# Altium project BÀI_1.PrjPcb (part 1 of 2)
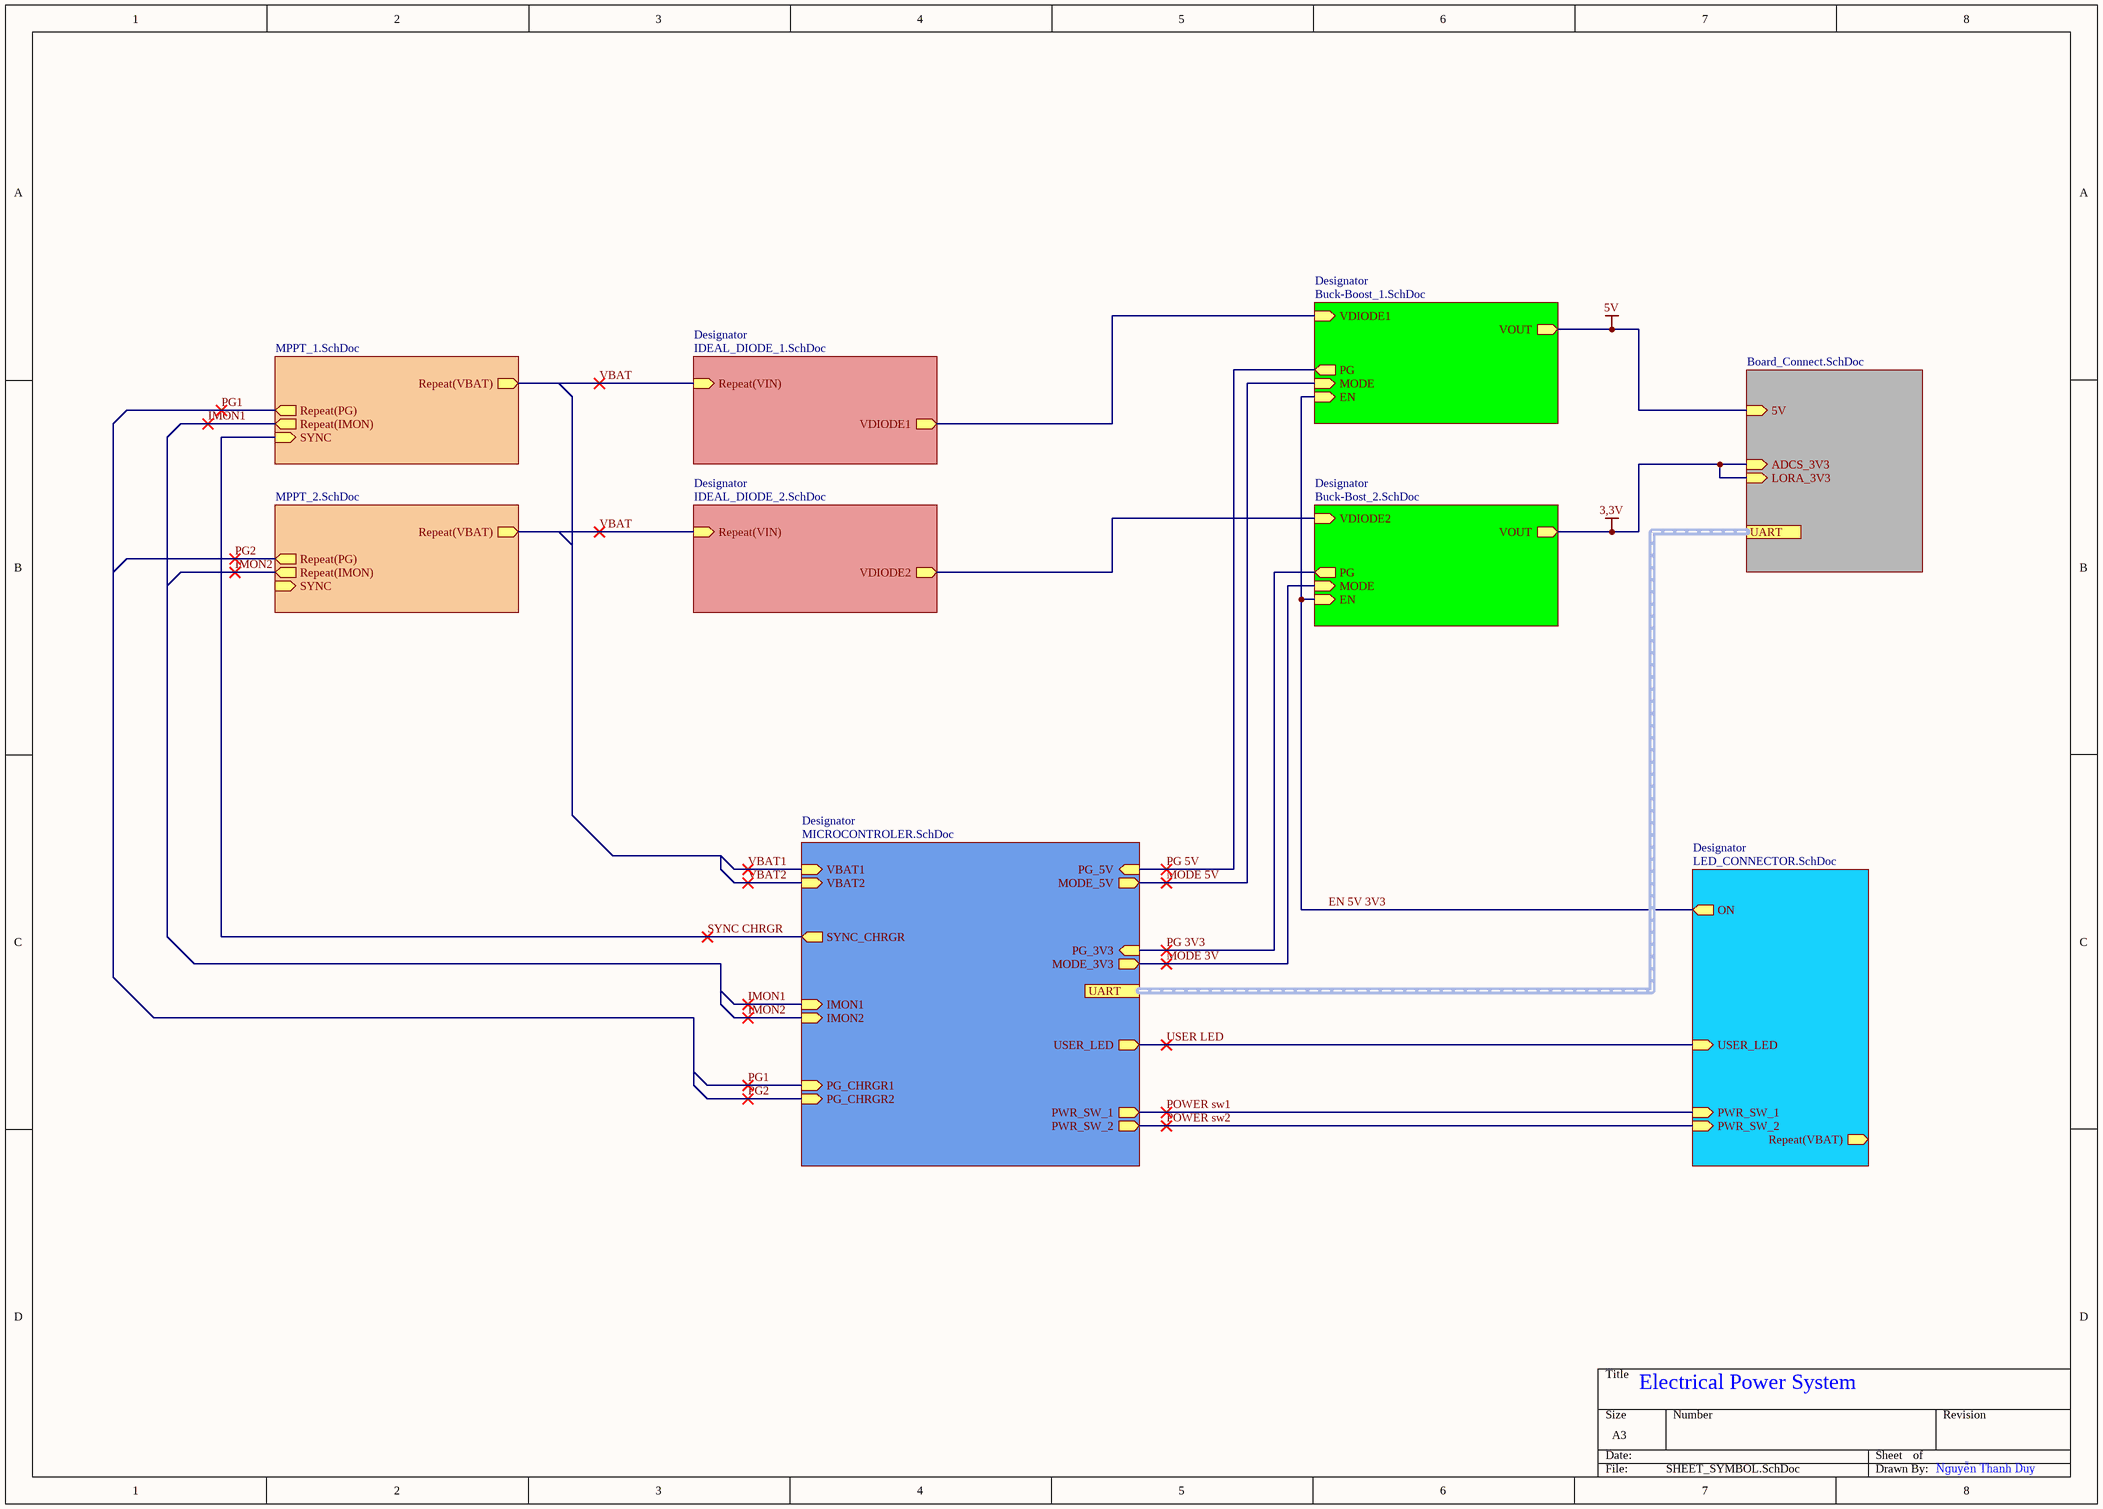
[diagram p0: SHEET_SYMBOL.SchDoc]
10 sheets, 124 parts. Net scope: flat (ports and power ports of the same name join across sheets).
Board files: PCB_4_LAYER.PcbDoc, PCB_2_LAYER.PcbDoc
Sheets:
  SHEET_SYMBOL.SchDoc
    Designator = MICROCONTROLER.SchDoc
    Designator = MPPT_1.SchDoc
    Designator = MPPT_2.SchDoc
    Designator = IDEAL_DIODE_1.SchDoc
    Designator = IDEAL_DIODE_2.SchDoc
    Designator = Buck-Boost_1.SchDoc
    Designator = Buck-Bost_2.SchDoc
    Designator = Board_Connect.SchDoc
    Designator = LED_CONNECTOR.SchDoc

## Sheet SHEET_SYMBOL.SchDoc
size A3; SheetNumber: 1; SheetTotal: 10

### Sub-sheets
Designator = MICROCONTROLER.SchDoc: VBAT1 (in), VBAT2 (in), SYNC_CHRGR (out), IMON1 (in), IMON2 (in), PG_CHRGR1 (in), PG_CHRGR2 (in), PG_5V (in), MODE_5V (out), PG_3V3 (in), MODE_3V3 (out), USER_LED (out), PWR_SW_1 (out), PWR_SW_2 (out)
Designator = MPPT_1.SchDoc: Repeat(PG) (out), Repeat(IMON) (out), Repeat(VBAT) (out), SYNC (in)
Designator = MPPT_2.SchDoc: Repeat(PG) (out), Repeat(IMON) (out), Repeat(VBAT) (out), SYNC (in)
Designator = IDEAL_DIODE_1.SchDoc: Repeat(VIN) (in), VDIODE1 (out)
Designator = IDEAL_DIODE_2.SchDoc: Repeat(VIN) (in), VDIODE2 (out)
Designator = Buck-Boost_1.SchDoc: VDIODE1 (in), PG (out), MODE (in), EN (in), VOUT (out)
Designator = Buck-Bost_2.SchDoc: VDIODE2 (in), PG (out), MODE (in), EN (in), VOUT (out)
Designator = Board_Connect.SchDoc: 5V (in), ADCS_3V3 (in), LORA_3V3 (in)
Designator = LED_CONNECTOR.SchDoc: ON (out), USER_LED (in), PWR_SW_1 (in), PWR_SW_2 (in), Repeat(VBAT) (out)

### Ports
UART (harness UART, see 1[5C], 3[2C], 10[1D]), UART (harness UART, see 1[7B], 3[2C], 10[1D])

### Nets
3,3V: sheet Designator/VOUT, sheet Designator/ADCS_3V3, sheet Designator/LORA_3V3
5V: sheet Designator/VOUT, sheet Designator/5V
EN 5V 3V3: sheet Designator/EN, sheet Designator/EN, sheet Designator/ON
IMON1: sheet Designator/IMON1, sheet Designator/Repeat(IMON)
IMON2: sheet Designator/IMON2, sheet Designator/Repeat(IMON)
MODE 3V: sheet Designator/MODE_3V3, sheet Designator/MODE
MODE 5V: sheet Designator/MODE_5V, sheet Designator/MODE
PG1: sheet Designator/PG_CHRGR1, sheet Designator/Repeat(PG)
PG2: sheet Designator/PG_CHRGR2, sheet Designator/Repeat(PG)
PG 3V3: sheet Designator/PG_3V3, sheet Designator/PG
PG 5V: sheet Designator/PG_5V, sheet Designator/PG
POWER sw1: sheet Designator/PWR_SW_1, sheet Designator/PWR_SW_1
POWER sw2: sheet Designator/PWR_SW_2, sheet Designator/PWR_SW_2
SYNC CHRGR: sheet Designator/SYNC_CHRGR, sheet Designator/SYNC
USER LED: sheet Designator/USER_LED, sheet Designator/USER_LED
VBAT: sheet Designator/Repeat(VBAT), sheet Designator/Repeat(VBAT), sheet Designator/Repeat(VIN), sheet Designator/Repeat(VIN)
VBAT1: sheet Designator/VBAT1
VBAT2: sheet Designator/VBAT2
(unnamed): sheet Designator/VDIODE1, sheet Designator/VDIODE1
(unnamed): sheet Designator/VDIODE2, sheet Designator/VDIODE2

### Notes on the sheet
- Electrical Power System
- Nguyễn Thanh Duy

## Sheet MICROCONTROLER.SchDoc
size A4; SheetNumber: 3; SheetTotal: 10
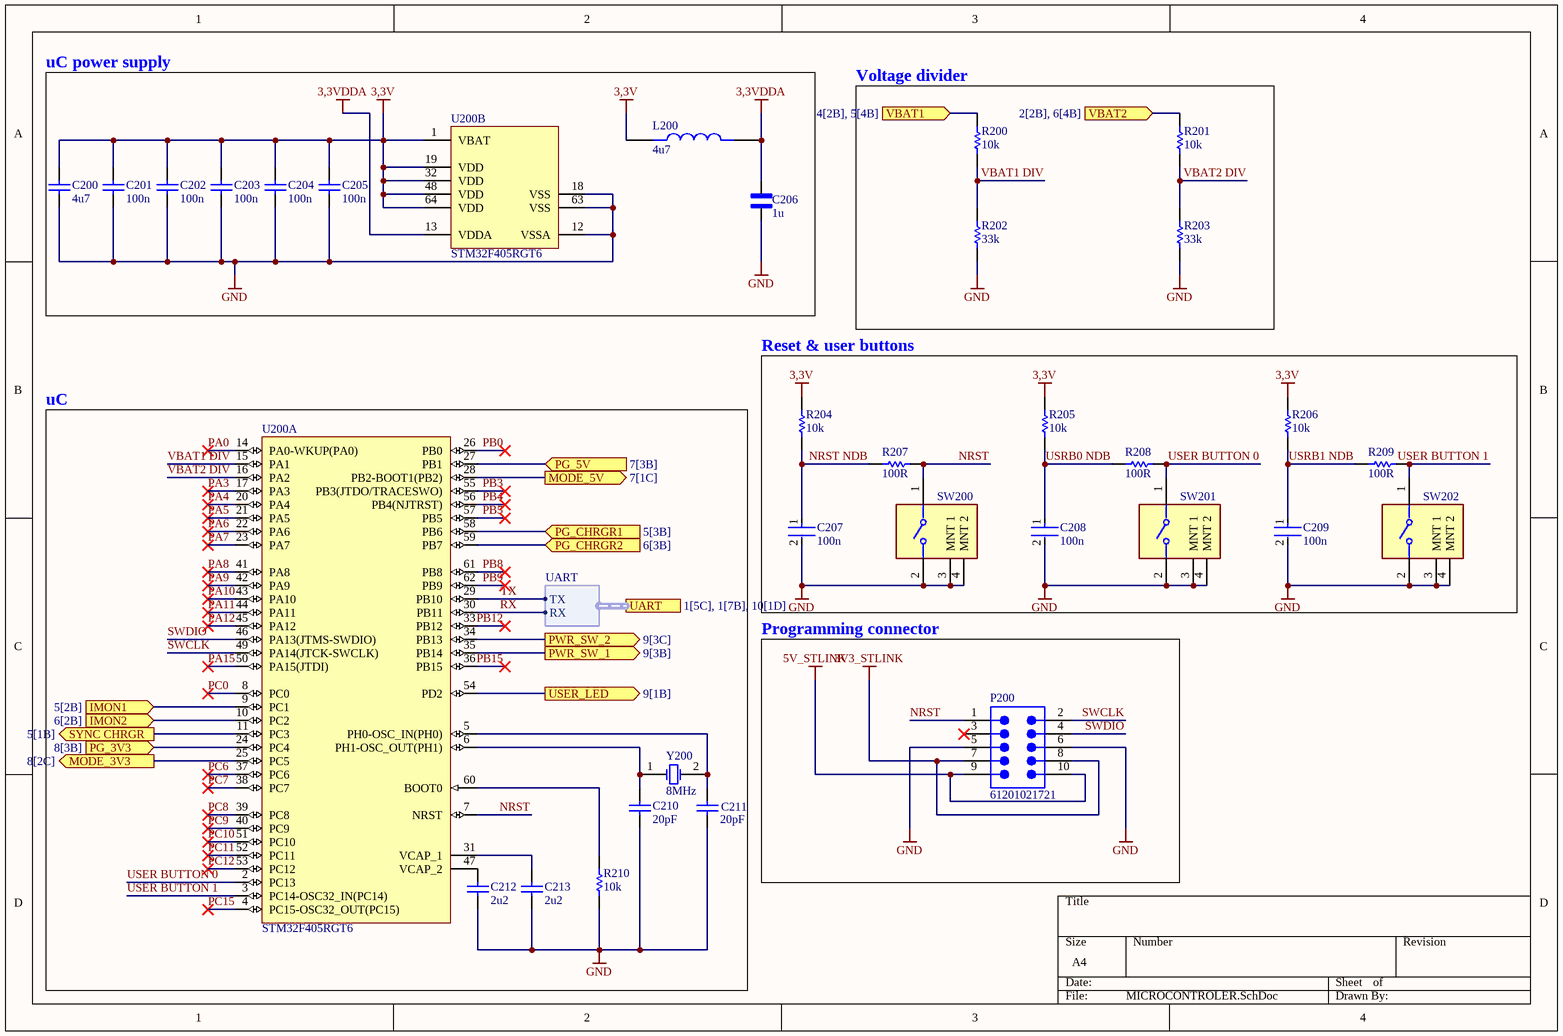
[diagram p1: MICROCONTROLER.SchDoc]

### Parts
C200  4u7  [CAPC1005X55X30LL05T10]
C201  100n  [CAPC1005X55X30LL05T10]
C202  100n  [CAPC1005X55X30LL05T10]
C203  100n  [CAPC1005X55X30LL05T10]
C204  100n  [CAPC1005X55X30LL05T10]
C205  100n  [CAPC1005X55X30LL05T10]
C206  1u  [CAPC1005X70N]
C207  100n  [FP-C0402-BB-MFG]
C208  100n  [FP-C0402-BB-MFG]
C209  100n  [FP-C0402-BB-MFG]
C210  20pF  [tu 0805]
C211  20pF  [tu 0805]
C212  2u2  [tu 0805]
C213  2u2  [tu 0805]
L200  4u7  [INDC2012X100N]
P200  61201021721  [61201021721]
R200  10k  [RESC1609X50X30NL8T20]
R201  10k  [RESC1609X50X30NL8T20]
R202  33k  [RESC1005X40X25ML05T10]
R203  33k  [RESC1005X40X25ML05T10]
R204  10k  [RESC1609X50X30NL8T20]
R205  10k  [RESC1609X50X30NL8T20]
R206  10k  [RESC1609X50X30NL8T20]
R207  100R  [RESC1005X40X25ML05T10]
R208  100R  [RESC1005X40X25ML05T10]
R209  100R  [RESC1005X40X25ML05T10]
R210  10k  [RESC1609X50X30NL8T20]
SW200  B3F-3152  [FP-B3F-3152-MFG]  (value not drawn)
SW201  B3F-3152  [FP-B3F-3152-MFG]  (value not drawn)
SW202  B3F-3152  [FP-B3F-3152-MFG]  (value not drawn)
U200  STM32F405RGT6  [STM-LQFP64_N]  (parts A,B of 2)
Y200  8MHz  [ABRA-ABLS-14.7456MHZ-B2-T_V]

### Blocks framed on the sheet
uC power supply: C200-C206 L200 U200
Voltage divider: R200-R203
uC: C210-C213 R210 U200 Y200
Reset & user buttons: C207-C209 R204-R209 SW200-SW202
Programming connector: P200

### Ports
IMON1 (in, see 5[2B]), IMON2 (in, see 6[2B]), MODE_3V3 (out, see 8[2C]), MODE_5V (out, see 7[1C]), PG_3V3 (in, see 8[3B]), PG_5V (in, see 7[3B]), PG_CHRGR1 (in, see 5[3B]), PG_CHRGR2 (in, see 6[3B]), PWR_SW_1 (out, see 9[3B]), PWR_SW_2 (out, see 9[3C]), SYNC CHRGR (out, see 5[1B]), UART (harness UART, see 1[5C], 1[7B], 10[1D]), USER_LED (out, see 9[1B]), VBAT1 (in, see 4[2B], 5[4B]), VBAT2 (in, see 2[2B], 6[4B])

### Harnesses
UART: TX, RX

### Nets
3,3V: C200.2 C201.2 C202.2 C203.2 C204.2 C205.2 L200.1 R204.2 R205.2 R206.2 U200.1(VBAT) U200.19(VDD) U200.32(VDD) U200.48(VDD) U200.64(VDD)
3,3VDDA: C206.2 L200.2 U200.13(VDDA)
3V3_STLINK: P200.7 P200.8
5V_STLINK: P200.9 P200.10
GND: C200.1 C201.1 C202.1 C203.1 C204.1 C205.1 C206.1 C207.2 C208.2 C209.2 C210.2 C211.2 C212.2 C213.2 P200.5 P200.6 R202.1 R203.1 R210.1 SW200.2 SW200.3(MNT_1) SW200.4(MNT_2) SW201.2 SW201.3(MNT_1) SW201.4(MNT_2) SW202.2 SW202.3(MNT_1) SW202.4(MNT_2) U200.12(VSSA) U200.18(VSS) U200.63(VSS)
G2: U200.34(PB13) ; port PWR_SW_2
NRST: P200.1 R207.2 SW200.1 U200.7(NRST)
NRST NDB: C207.1 R204.1 R207.1
PA0: U200.14(PA0-WKUP(PA0))
PA3: U200.17(PA3)
PA4: U200.20(PA4)
PA5: U200.21(PA5)
PA6: U200.22(PA6)
PA7: U200.23(PA7)
PA8: U200.41(PA8)
PA9: U200.42(PA9)
PA10: U200.43(PA10)
PA11: U200.44(PA11)
PA12: U200.45(PA12)
PA15: U200.50(PA15(JTDI))
PB0: U200.26(PB0)
PB3: U200.55(PB3(JTDO/TRACESWO))
PB4: U200.56(PB4(NJTRST))
PB5: U200.57(PB5)
PB8: U200.61(PB8)
PB9: U200.62(PB9)
PB12: U200.33(PB12)
PB15: U200.36(PB15)
PC0: U200.8(PC0)
PC6: U200.37(PC6)
PC7: U200.38(PC7)
PC8: U200.39(PC8)
PC9: U200.40(PC9)
PC10: U200.51(PC10)
PC11: U200.52(PC11)
PC12: U200.53(PC12)
PC15: U200.4(PC15-OSC32_OUT(PC15))
PG: U200.58(PB6) ; port PG_CHRGR1
PG B: U200.59(PB7) ; port PG_CHRGR2
RX: U200.30(PB11) ; port UART.RX
SWCLK: P200.2 U200.49(PA14(JTCK-SWCLK))
SWDIO: P200.4 U200.46(PA13(JTMS-SWDIO))
TX: U200.29(PB10) ; port UART.TX
USER BUTTON 0: R208.2 SW201.1 U200.2(PC13)
USER BUTTON 1: R209.2 SW202.1 U200.3(PC14-OSC32_IN(PC14))
USRB0 NDB: C208.1 R205.1 R208.1
USRB1 NDB: C209.1 R206.1 R209.1
VBAT1 DIV: R200.1 R202.2 U200.15(PA1)
VBAT2 DIV: R201.1 R203.2 U200.16(PA2)
Net?_2: R200.2 ; port VBAT1
NetC210_1: C210.1 U200.6(PH1-OSC_OUT(PH1)) Y200.1(X1)
NetC211_1: C211.1 U200.5(PH0-OSC_IN(PH0)) Y200.2(X2)
NetC212_1: C212.1 U200.47(VCAP_2)
NetC213_1: C213.1 U200.31(VCAP_1)
NetC303B_1: R201.2 ; port VBAT2
NetD700_2: U200.54(PD2) ; port USER_LED
NetR210_2: R210.2 U200.60(BOOT0)
NetR302A_1: U200.11(PC3) ; port SYNC CHRGR
NetR500A_1: U200.28(PB2-BOOT1(PB2)) ; port MODE_5V
NetR500B_1: U200.25(PC5) ; port MODE_3V3
NetR700_1: U200.35(PB14) ; port PWR_SW_1
NetU200_9: U200.9(PC1) ; port IMON1
NetU200_10: U200.10(PC2) ; port IMON2
NetU200_24: U200.24(PC4) ; port PG_3V3
NetU200_27: U200.27(PB1) ; port PG_5V

Not connected (* = marked no-connect by the designer): P200 3*

### Library data of the parts
C200-C205 = CMP-0001-00074-2: Manufacturer: Kemet; Part Number: C0402C104K4RACTU
C206 = MAASL105CD7105MFCA01: MF: Taiyo Yuden; SnapEDA_Link: https://www.snapeda.com/parts/MAASL105CD7105MFCA01/Littelfuse/view-part/?ref=snap; Package: None; Value: *; MP: MAASL105CD7105MFCA01; Check_prices: https://www.snapeda.com/parts/MAASL105CD7105MFCA01/Littelfuse/view-part/?ref=eda
C207-C209 = CMP-2008-02046-2: CAP CER 0.1UF 10V X5R 0402; Manufacturer: Kemet; Manufacturer Part Number: C0402C104K8PACTU; Material: Ceramic; Capacitance: 0.10 μF; Temperature Coefficient: 15%; Tolerance: 0.1; Value: 0.10 μF; Package: C0402-BB; Temperature: -55°C to +125°C; ComponentLink2Description: Datasheet; Temperature Characteristic: X5R; Device Class L1: Passive Components; Height: 0.55mm; Lead Free: Yes; ComponentLink2URL: https://content.kemet.com/datasheets/KEM_C1002_X7R_SMD.pdf; Device Class L2: Capacitors; Temperature Range Low: -55°C; Temperature Range High: +125°C; RoHS: TRUE; Octopart: https://octopart.com/c0402c104k8pactu-kemet-140039; Automotive: No; Mouser Description: Capacitor 100 nF 10 VDC 0402; Category: Cap; Voltage Rating: 10 V; Digikey Description: CAP CER 0.1UF 10V X5R 0402; Ipc Land Pattern Name: CAPC10050X50; Device Class L3: Ceramic Capacitors
C210 C211 = Tu 0805 20pF 50V 10%: Dán; Don_Vi: Con; Ten_Linh_Kien: Tụ 0805 20P 10% 50V; So_Chan: 2; Ma_Hang: MH004558; Chung_Loai: Dán; Kieu_Chan: *
C212 C213 = Tu 0805 225 25V 10%: Dán; Don_Vi: Con; So_Chan: 2; Ten_Linh_Kien: Tụ 0805 225-2.2uF 25V 10%; Ma_Hang: MH007483; Chung_Loai: Dán; Kieu_Chan: *
L200 = MLP2012S4R7MT0S1: Surface Mount High Frequency Inductor, MLP Series, 4.7 H, 20%, 0805 [2012 Metric], 0.26 ohm; MF: TDK; Package: 2012 TDK; Price: None; Check_prices: https://www.snapeda.com/parts/MLP2012S4R7MT0S1/TDK/view-part/?ref=eda; Value: *; SnapEDA_Link: https://www.snapeda.com/parts/MLP2012S4R7MT0S1/TDK/view-part/?ref=snap; MP: MLP2012S4R7MT0S1; Availability: In Stock; Purchase-URL: https://pricing.snapeda.com/search/part/MLP2012S4R7MT0S1/?ref=eda
P200 = CMP-1502-00021-2: NexarPartId: 8917787; Operating Supply Voltage: 250V; Number of Positions: 10; Contact Resistance: 20mΩ; Connector Type: Male Pin; Current Rating: 3A; Pitch: 2.54mm; Gender: Male; Insulation Resistance: 1GΩ; Insulation: Insulated; Max Operating Temperature: 105°C; Flammability Rating: UL94 V-0; Mount: Through Hole; Contact Material: Copper; Min Operating Temperature: -40°C; Length: 20.36mm; Number of Contacts: 10; Height: 8.85mm; Number of Rows: 2; Housing Material: PBT; Color: Black; Contact Gender: Male; Orientation: Right Angle; Contact Plating: Gold; Number of Pins: 10; Voltage Rating (DC): 250V; RoHS: Compliant; Insulation Material: PBT; REACH SVHC: Unknown; Row Spacing: 2.54mm; Voltage Rating: 250V; Width: 20.36mm; Lead Pitch: 2.54mm; Termination: Through Hole
R200 R201 R204-R206 R210 = CMP-1666-00005-4: Chip Resistor, 10 KOhm, +/- 1%, 100 mW, -55 to 155 degC, 0603 (1608 Metric), RoHS, Tape and Reel; Manufacturer: Vishay Semiconductor; Voltage Rating: 75 V; Max Operating Temperature: 155 degC; PackageDescription: 2-Pin Surface Mount Device, Body 1.575 x 0.85 mm; ComponentLink1Description: Manufacturer URL; RoHSCompliant: true; PackageReference: 0603; REACH SVHC: Unknown; Length: 1.55 mm; DatasheetVersion: 06/2012; Packaging: Tape and Reel; Min Operating Temperature: -55 degC; Mounting Technology: Surface Mount; ComponentLink2URL: https://datasheet.ciiva.com/11809/0900766b80d98afc-11809037.pdf; Height: 0.45 mm; ComponentLink2Description: Datasheet; Package Quantity: 5000; ComponentLink1URL: http://www.vishay.com/
R202 R203 = CMP-2002-07617-1: Part Number: RC0402FR-0733KL; Manufacturer: Yageo / Phycomp
R207-R209 = CMP-2002-07344-1: Part Number: RC0402FR-07100RL; Manufacturer: Yageo / Phycomp
SW200-SW202 = CMP-08834-000033-1: SWITCH TACTILE SPST-NO 0.05A 24V; Mechanical Life: 300000Cycles; Max Current Rating: 50mA; Illumination Type: Non-Illuminated; Actuator Color: Yellow; Throw Configuration: SPST; Switch Function: Off-Mom; Ratings: IP00; Switch Travel: 0.25mm; Actuator Type: PLUNGER; Contact Resistance: 100mR; Number of Poles: 1; Operating Force: 1.47N; Height: 6.15mm; Contact Plating: Gold; Contact Type: 1 maker; Termination: PC Pins; Radiation Hardening: No; Contact Material: Gold; Number of Pins: 4; Length: 7.3mm; Width: 6mm; Weight: 0.25g; Packaging: Bulk; Contact Current Rating: 50mA; Max Operating Temperature: 70°C; Lead Free: Lead Free; Mount: Through Hole; RoHS Compliant: Yes; Series: B3F; Orientation: Right Angle; Package Quantity: 1000; Current Rating: 50mA; Max Voltage Rating (DC): 24V; Min Operating Temperature: -25°C; Electrical Life: 300000Cycles; Depth: 7.15mm; Voltage Rating (DC): 24V
U200 = CMP-0243-00019-3: ARM Cortex-M4 32-bit MCU+FPU, 210 DMIPS, 1024 kB Flash, 192 kB Internal RAM, 51 I/Os, 64-pin LQFP, -40 to 85 degC, Tray; Manufacturer: STMicroelectronics; Supply Voltage(Vcc) min (V): 1.8; Supply Voltage(Vcc) max (V): 3.6; Internal RAM Size (kB): 192; I/Os (High Current): 51; D/A Converter: 2x12-bit; FLASH Size (Prog) (kB): 1024; Operating Frequency(F) (Processor speed) (MHz): 168; ComponentLink2Description: Datasheet; PackageVersion: Rev. 4, 06/2013; DatasheetVersion: Rev. 4; Core: ARM Cortex-M4; ComponentLink2URL: http://www.st.com/st-web-ui/static/active/en/resource/technical/document/datasheet/DM00037051.pdf; PackageReference: LQFP64; Packing: Tray; ComponentLink1Description: Manufacturer URL; ComponentLink3URL: http://www.st.com/st-web-ui/static/active/en/resource/technical/document/datasheet/DM00037051.pdf; ComponentLink3Description: Package Specification; Mounting Technology: Surface Mount; ComponentLink1URL: http://www.st.com/web/en/home.html; PackageDescription: 64-Pin Low Profile Quad Flat Package, 10 x 10 mm Body, 0.5 mm Pitch; PartNumber: STM32F405RGT6
Y200 = CMP-2000-05726-1: Low Profile Crystal, 8.0 MHz, +/- 30 ppm, -20 to 70 degC, 2-Pin SMD, RoHS, Tape and Reel; Brand: ABRACON; Case Length: 11.4mm; Frequency Stability: 50PPM; ESR: 80Ohms; Case Height: 4.2mm; Tolerance: 30PPM; Case Width: 4.7mm; Load Capacitance: 18pF; Datasheet Version: 04/2011; Termination Style: SMD/SMT; Dimensions: 4.7mmWx11.4mmLx4.2mmH; Packaging: Reel; Manufacturer: ABRACON; Package URL: http://www.abracon.com/Support/PackageDrawing/Resonators/ABLS-2D.pdf; Mounting Technology: SurfaceMount; Package Reference: ABLS-14.7456MHZ-B2-T; Product Category: Crystals; Package Description: 2-Pin Surface Mount Device, Body 11.4 x 4.7 mm; Package / Case: HC-49/US; Mounting Style: SMD/SMT; Operating Temperature Range: -20Cto+70C; Series: ABLS; Frequency: 8MHz; Factory Pack Quantity: 1000; Datasheet URL: http://www.abracon.com/Resonators/abls.pdf; Manufacturer URL: http://www.abracon.com/; RoHS: Details; Type: LowProfileMicroprocessorCrystal

## Sheet MPPT_1.SchDoc
size A4; SheetNumber: 5; SheetTotal: 10
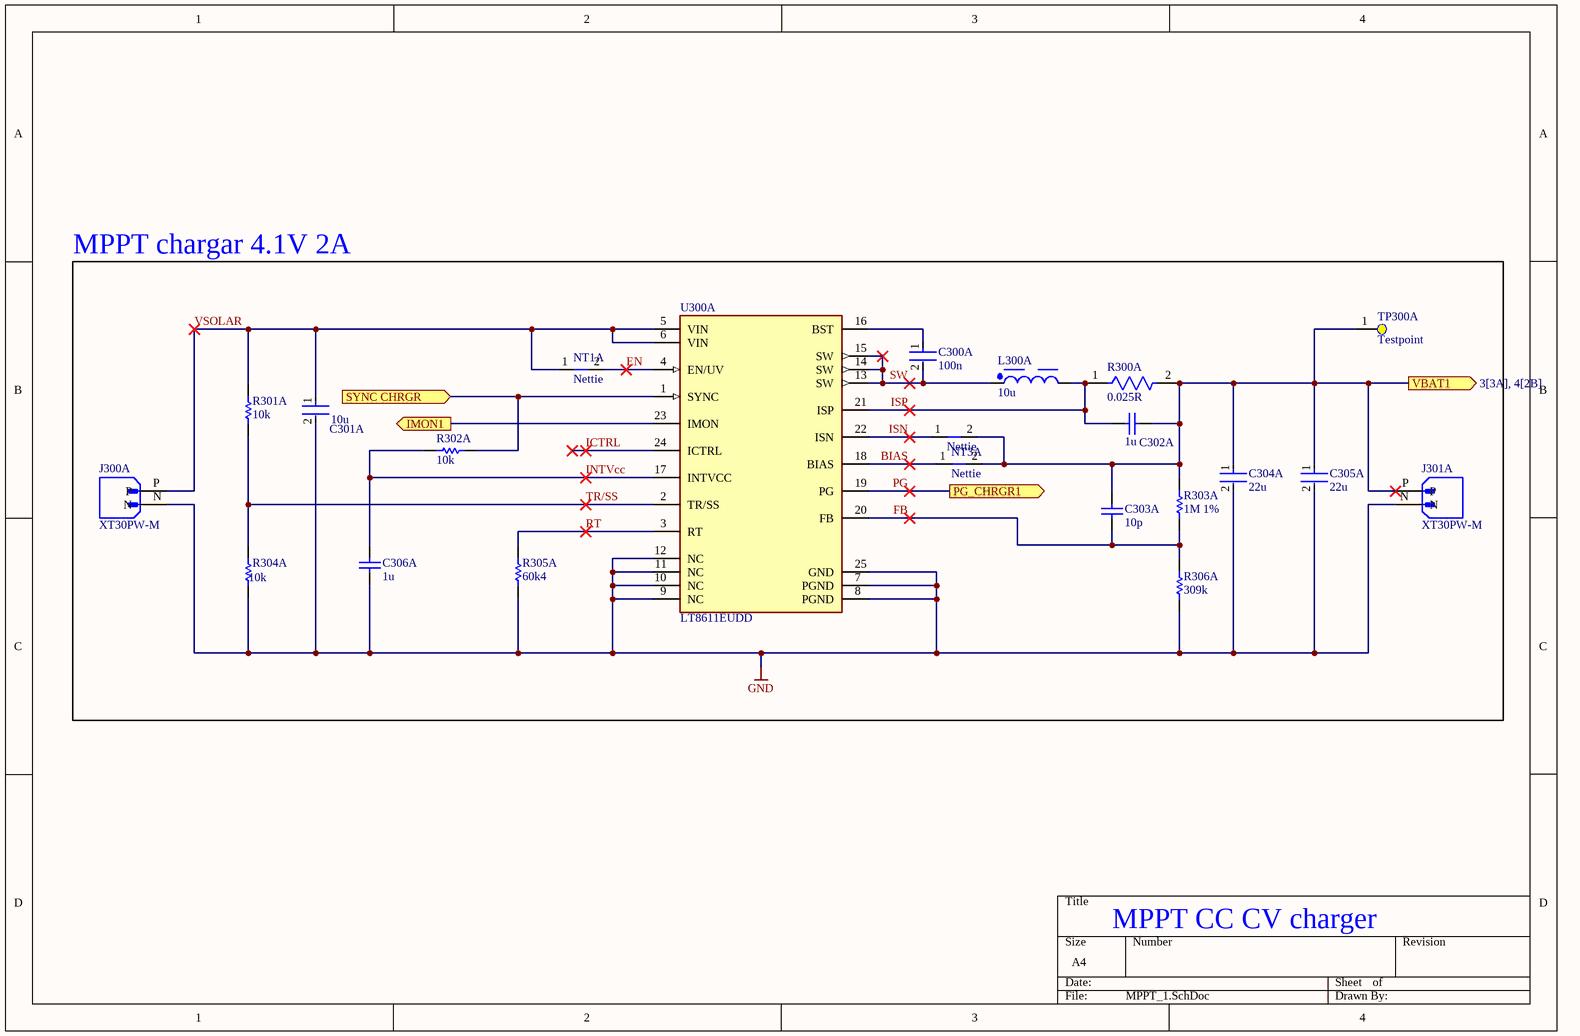
[diagram p2: MPPT_1.SchDoc]

### Parts
?  Nettie  [NET_TIE]
C300A  100n  [FP-0402B104K500CT-IPC_C]
C301A  10u  [FP-GRM31C-0_2-e0_3_0_8-MFG]
C302A  1u  [CAPC3216X110X50LL20T25]
C303A  10p  [CAPC1608X90X35LL10T15]
C304A  22u  [FP-GRM21B-0_15-IPC_B]
C305A  22u  [FP-GRM21B-0_15-IPC_B]
C306A  1u  [CAPC2013X140X50NL20T25]
J300A  XT30PW-M  [AMASS_XT30PW-M]
J301A  XT30PW-M  [AMASS_XT30PW-M]
L300A  10u  [WE-PD_7345]
NT1A  Nettie  [NET_TIE]
NT3A  Nettie  [NET_TIE]
R300A  0.025R  [FP-WSL2512-0_762-MFG]
R301A  10k  [RESC1609X50X30NL8T20]
R302A  10k  [RESC1609X50X30NL8T20]
R303A  1M 1%  [RESC1005X40X25NL05T10]
R304A  10k  [RESC1609X50X30NL8T20]
R305A  60k4  [RESC2013X50X30NL20T20]
R306A  309k  [RESC3216X70X50LL05T20]
TP300A  Testpoint  [Testpoint]
U300A  LT8611EUDD  [FP-UDD-24-05-08-1833-IPC_B]

### Blocks framed on the sheet
MPPT chargar 4.1V 2A: ? C300A C301A C302A C303A C304A C305A C306A J300A J301A L300A NT1A NT3A R300A R301A R302A R303A R304A R305A R306A TP300A U300A

### Ports
IMON1 (out, see 3[1C]), PG_CHRGR1 (out, see 3[2C]), SYNC CHRGR (in, see 3[1C]), VBAT1 (out, see 3[3A], 4[2B])

### Nets
GND: C301A.2 C304A.2 C305A.2 C306A.1 J300A.N J301A.N R304A.2 R305A.1 R306A.1 U300A.7(PGND) U300A.8(PGND) U300A.9(NC) U300A.10(NC) U300A.11(NC) U300A.12(NC) U300A.25(GND)
BIAS: NT3A.1 U300A.18(BIAS)
EN: NT1A.2 U300A.4(EN/UV)
FB: C303A.2 R303A.1 R306A.2 U300A.20(FB)
ICTRL: U300A.24(ICTRL)
INTVcc: C306A.2 R302A.2 U300A.17(INTVCC)
ISN: ?.1 U300A.22(ISN)
ISP: C302A.1 L300A.2 R300A.1 U300A.21(ISP)
PG: U300A.19(PG) ; port PG_CHRGR1
RT: R305A.2 U300A.3(RT)
SW: C300A.2 L300A.1 U300A.13(SW) U300A.14(SW) U300A.15(SW)
TR/SS: R301A.2 R304A.1 U300A.2(TR/SS)
VSOLAR: C301A.1 J300A.P NT1A.1 R301A.1 U300A.5(VIN) U300A.6(VIN)
Net?_2: ?.2 C302A.2 C303A.1 C304A.1 C305A.1 J301A.P NT3A.2 R300A.2 R303A.2 TP300A.1 ; port VBAT1
NetC300A_1: C300A.1 U300A.16(BST)
NetR302A_1: R302A.1 U300A.1(SYNC) ; port SYNC CHRGR
NetU200_9: U300A.23(IMON) ; port IMON1

### Notes on the sheet
- MPPT CC CV charger

### Library data of the parts
C300A = CMP-45632-000010-1: CAP CER 0.1UF 50V X7R 0402; Tolerance: 10%; Capacitance: 100nF; Max Operating Temperature: 125°C; Case Code (Metric): 1005; RoHS Compliant: Yes; Series: -; Case Code (Imperial): 0402; Voltage Rating: 50V; Min Operating Temperature: -55°C; Mount: Surface Mount; Case/Package: 0402; Packaging: Cut Tape
C301A = CMP-06035-003589-1: Chip Multilayer Ceramic Capacitors for General Purpose, 1206, 10uF, X7R, 15%, 10%, 25V; Case Code (Imperial): 1206; Voltage Rating (DC): 25V; Voltage Rating: 25V; Length: 3.2mm; Lead Free: Lead Free; Thickness: 0.071inch; Package Quantity: 1; Width: 1.6mm; Max Operating Temperature: 125°C; Number of Pins: 2; Height: 1.6mm; Case Code (Metric): 3216; REACH SVHC: No SVHC; Radiation Hardening: No; Case/Package: 1206; Material: Ceramic; Tolerance: 10%; Voltage: 25V; Mount: Surface Mount; Packaging: Tape and Reel; Dielectric: X7R; Termination: SMD/SMT; Min Operating Temperature: -55°C; Capacitance: 10uF; Depth: 1.6mm
C302A = CMP-2000-06011-1: Chip Capacitor, 1 uF, +/- 10%, 50 V, -55 to 125 degC, 1206 (3216 Metric), RoHS, Tape and Reel; Manufacturer: Kemet; Case Height: 1mm; Dielectric: X7R; Voltage Rating: 50V; Capacitance: 1uF; Temperature Coefficient / Code: +/-15%; Case Length: 3.2mm; Case Width: 1.6mm; Type: SMDMLCCX7R6.3-250VDCCommericalGrade; Class: Class1; Capacitance - nF: 1000nF; Datasheet URL: http://www.kemet.com/docfinder?Partnumber=C1206C105K5RACTU; Product Category: MultilayerCeramicCapacitorsMLCC-SMD/SMT; Termination Style: SMD/SMT; Dimensions: 1.6mmWx3.2mmLx1mmH; Voltage Rating DC: 50V; Datasheet Version: 02/2016; Packaging: Reel; Brand: Kemet; RoHS: Details; Minimum Operating Temperature: -55C; Operating Temperature Range: -55Cto+125C; Package Reference: 1206; Manufacturer URL: http://www.kemet.com/; Product: GeneralTypeMLCCs; Tolerance: 10%; Package Description: 2-Pin Surface Mount Device, Body 3.2 x 1.6 mm; Mounting Technology: SurfaceMount; Case Code - mm: 3216; Maximum Operating Temperature: +125C; Series: C1206C; Factory Pack Quantity: 2500; Package / Case: 1206(3216metric); Case Code - in: 1206
C303A = CMP-2006-02592-1: Part Number: GRM1885C1H100JA01D; Manufacturer: Murata
C304A C305A = CMP-2007-03385-2: Chip Multilayer Ceramic Capacitors for General Purpose, 0805, 22uF, X5R, 15%, 20%, 6.3V; Material: Ceramic; Max Operating Temperature: 85°C; Voltage: 6.3V; Min Operating Temperature: -55°C; Case/Package: 0805; Thickness: 0.053inch; Dielectric: X5R; Packaging: Tape and Reel; Depth: 1.25mm; Termination: SMD/SMT; Voltage Rating (DC): 6.3V; Radiation Hardening: No; Tolerance: 20%; Mount: Surface Mount; Lead Free: Lead Free; Package Quantity: 1; REACH SVHC: No SVHC; Voltage Rating: 6.3V; Capacitance: 22uF; Length: 2mm; Case Code (Imperial): 0805; Case Code (Metric): 2012; Width: 0.049inch; Height: 1.25mm
C306A = CMP-2007-03234-1: Part Number: C0805C105K3RACTU; Manufacturer: Kemet
J300A J301A = XT30PW-M: Socket; DC supply; XT30; male; PIN: 2; on PCBs; THT; Colour: yellow; MF: AMASS; SnapEDA_Link: https://www.snapeda.com/parts/XT30PW-M/AMASS/view-part/?ref=snap; Package: None; Value: *; MP: XT30PW-M; Check_prices: https://www.snapeda.com/parts/XT30PW-M/AMASS/view-part/?ref=eda
L300A = CMP-0227-00113-2: 74477710, CUỘN CẢM LÕI FERALIT; NexarPartId: 11853718; Saturation Current: 2.6A; Current Rating: 2A; DC Resistance (DCR): 45mΩ; Inductance Tolerance: 20%; Core Material: Ferrite; Shielding: Shielded; Test Frequency: 1kHz; Inductance: 10µH; Self Resonant Frequency: 23MHz; RoHS: Compliant; Ambient Temperature Range Low: -40°C; Case/Package: Nonstandard; Composition: Wirewound; Height - Seated (Max): 4.4958mm; Mount: Surface Mount; Max DC Current: 2A; Length: 7.3mm; Termination: SMD/SMT; Depth: 7.3mm; Lead Pitch: 4mm; Ambient Temperature Range High: 85°C; Max Operating Temperature: 125°C; Width: 7.3mm; Lead Free: Lead Free; Min Operating Temperature: -40°C; Tolerance: 20%; Packaging: Cut Tape (CT); Number of Pins: 2; Height: 4.5mm
R300A = CMP-02407-013157-1: RES 0.025 OHM 1% 1W 2512; Resistance: 25mR; Voltage Rating: 150mV; Temperature Coefficient: 75ppm/°C; Features: Moisture Resistant; Number of Pins: 2; RoHS Compliant: No; Packaging: Tape and Reel; Power Rating: 1W; Height: 0.635mm; Tolerance: 1%; Case Code (Imperial): 2512; Number of Terminations: 2; Resistor Type: Metal Strip; Technology: METAL STRIP; Case Code (Metric): 6432; Max Operating Temperature: 170°C; Package Quantity: 2000; Termination: SMD/SMT; Reach SVHC Compliant: Yes; Width: 3.2mm; Military Standard: Not; Construction: Rectangular; Contact Plating: Tin; Radiation Hardening: No; Lead Free: Lead Free; Weight: 0.002243oz; Max Power Dissipation: 1W; Min Operating Temperature: -65°C; Resistance Tolerance: 1%; Case/Package: 2512; Depth: 3.18mm; Length: 6.4mm; Size Code: 2512; Series: WSL
R301A R302A R304A = CMP-1666-00005-4: as R200 on sheet MICROCONTROLER; Max Operating Temperature: 155 degC; PackageDescription: 2-Pin Surface Mount Device, Body 1.575 x 0.85 mm; ComponentLink1Description: Manufacturer URL; RoHSCompliant: true; PackageReference: 0603; REACH SVHC: Unknown; Length: 1.55 mm; DatasheetVersion: 06/2012; Packaging: Tape and Reel; Min Operating Temperature: -55 degC; Mounting Technology: Surface Mount; ComponentLink2URL: https://datasheet.ciiva.com/11809/0900766b80d98afc-11809037.pdf; Height: 0.45 mm; ComponentLink2Description: Datasheet; Package Quantity: 5000; ComponentLink1URL: http://www.vishay.com/
R303A = CMP-2002-07490-1: Manufacturer: Yageo / Phycomp; Part Number: RC0402FR-071ML
R305A = CMP-2001-04043-1: Manufacturer: Vishay Dale; Part Number: CRCW080560K4FKEA
R306A = CMP-2003-00293-1: ERJ-8ENF3093V; Manufacturer: Panasonic; Part Number: ERJ-8ENF3093V
U300A = CMP-0491-02169-2: IC REG BUCK ADJ 2.5A 24QFN; Synchronous Rectifier: Yes; Number of Outputs: 1; Output Type: Adjustable; Switching Frequency: 2MHz; Efficiency: 96%; Output Voltage: 40V; Max Operating Temperature: 125°C; Output Current: 2.5A; RoHS Compliant: Yes; Case/Package: QFN; Package Quantity: 2500; Lead Free: Lead Free; Series: -; Number of Pins: 24; Min Operating Temperature: -40°C; Packaging: Tape and Reel

## Sheet MPPT_2.SchDoc
size A4; SheetNumber: 6; SheetTotal: 10
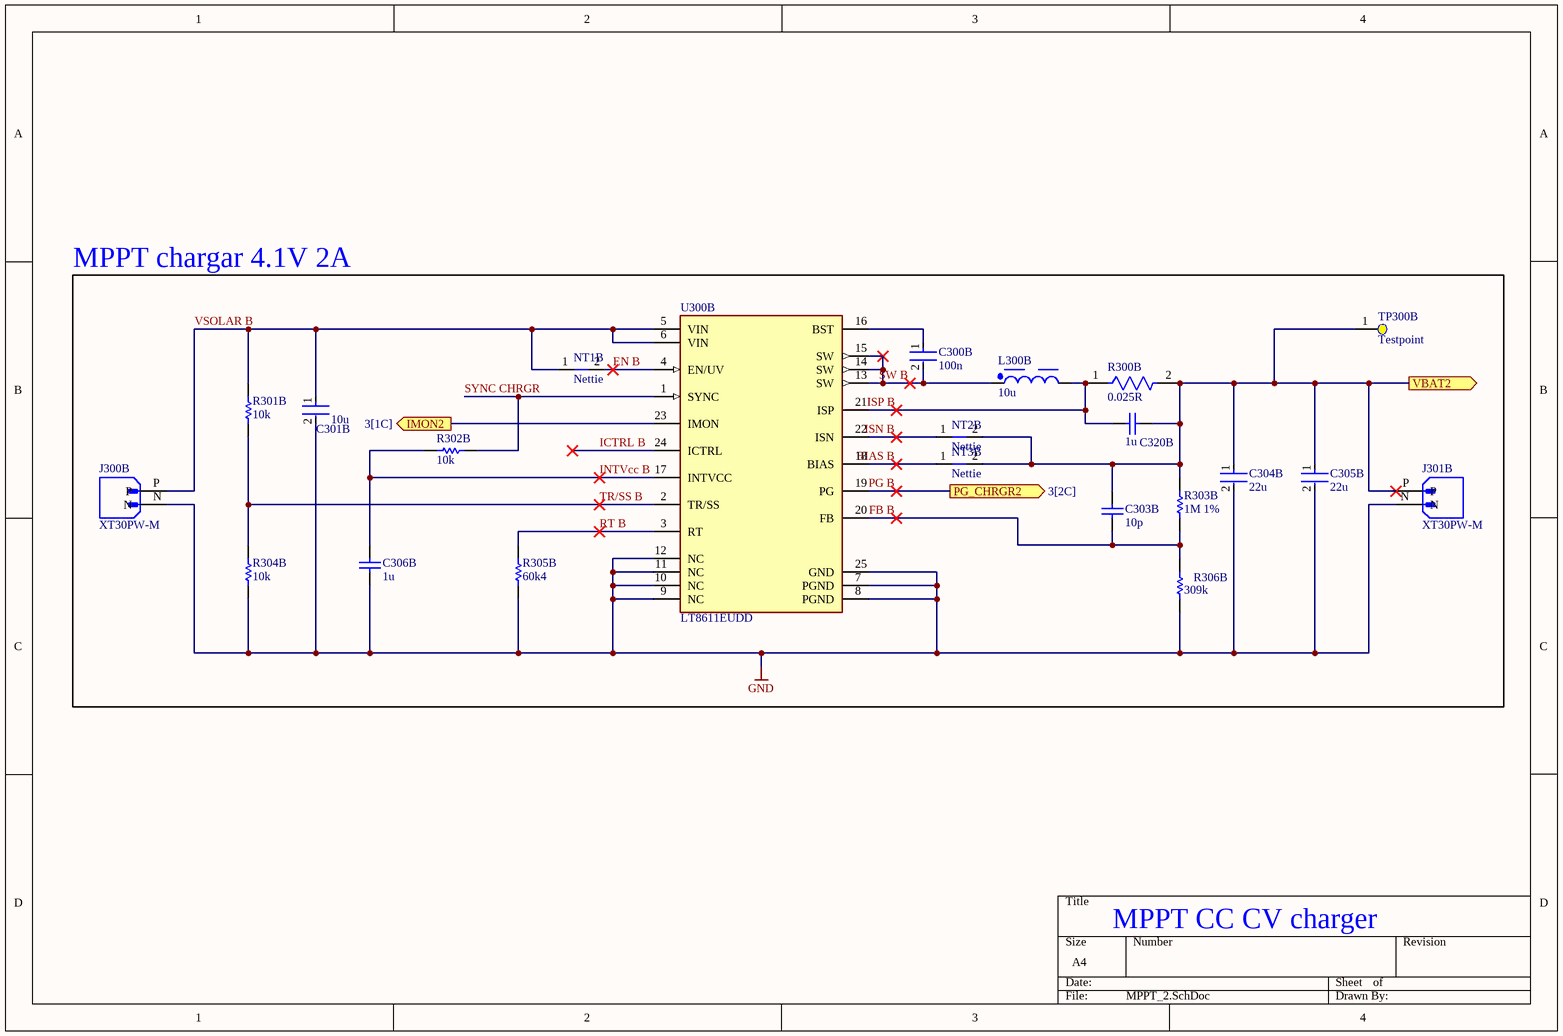
[diagram p3: MPPT_2.SchDoc]

### Parts
C300B  100n  [FP-0402B104K500CT-IPC_C]
C301B  10u  [FP-GRM31C-0_2-e0_3_0_8-MFG]
C303B  10p  [CAPC1608X90X35LL10T15]
C304B  22u  [FP-GRM21B-0_15-IPC_B]
C305B  22u  [FP-GRM21B-0_15-IPC_B]
C306B  1u  [CAPC2013X140X50NL20T25]
C320B  1u  [CAPC3216X110X50LL20T25]
J300B  XT30PW-M  [AMASS_XT30PW-M]
J301B  XT30PW-M  [AMASS_XT30PW-M]
L300B  10u  [WE-PD_7345]
NT1B  Nettie  [NET_TIE]
NT2B  Nettie  [NET_TIE]
NT3B  Nettie  [NET_TIE]
R300B  0.025R  [FP-WSL2512-0_762-MFG]
R301B  10k  [RESC1609X50X30NL8T20]
R302B  10k  [RESC1609X50X30NL8T20]
R303B  1M 1%  [RESC1005X40X25NL05T10]
R304B  10k  [RESC1609X50X30NL8T20]
R305B  60k4  [RESC2013X50X30NL20T20]
R306B  309k  [RESC3216X70X50LL05T20]
TP300B  Testpoint  [Testpoint]
U300B  LT8611EUDD  [FP-UDD-24-05-08-1833-IPC_B]

### Blocks framed on the sheet
MPPT chargar 4.1V 2A: C300B C301B C303B C304B C305B C306B C320B J300B J301B L300B NT1B NT2B NT3B R300B R301B R302B R303B R304B R305B R306B TP300B U300B

### Ports
IMON2 (out, see 3[1C]), PG_CHRGR2 (out, see 3[2C]), VBAT2 (out, see 2[2B], 3[3A])

### Nets
GND: C301B.2 C304B.2 C305B.2 C306B.1 J300B.N J301B.N R304B.2 R305B.1 R306B.1 U300B.7(PGND) U300B.8(PGND) U300B.9(NC) U300B.10(NC) U300B.11(NC) U300B.12(NC) U300B.25(GND)
BIAS B: NT3B.1 U300B.18(BIAS)
EN B: NT1B.2 U300B.4(EN/UV)
FB B: C303B.2 R303B.1 R306B.2 U300B.20(FB)
ICTRL B: U300B.24(ICTRL)
INTVcc B: C306B.2 R302B.2 U300B.17(INTVCC)
ISN B: NT2B.1 U300B.22(ISN)
ISP B: C320B.1 L300B.2 R300B.1 U300B.21(ISP)
PG B: U300B.19(PG) ; port PG_CHRGR2
RT B: R305B.2 U300B.3(RT)
SW B: C300B.2 L300B.1 U300B.13(SW) U300B.14(SW) U300B.15(SW)
SYNC CHRGR: R302B.1 U300B.1(SYNC)
TR/SS B: R301B.2 R304B.1 U300B.2(TR/SS)
VSOLAR B: C301B.1 J300B.P NT1B.1 R301B.1 U300B.5(VIN) U300B.6(VIN)
NetC300B_1: C300B.1 U300B.16(BST)
NetC303B_1: C303B.1 C304B.1 C305B.1 C320B.2 J301B.P NT2B.2 NT3B.2 R300B.2 R303B.2 TP300B.1 ; port VBAT2
NetU200_10: U300B.23(IMON) ; port IMON2

### Notes on the sheet
- MPPT CC CV charger

### Library data of the parts
C300B = CMP-45632-000010-1: as C300A on sheet MPPT_1; Max Operating Temperature: 125°C; Case Code (Metric): 1005; RoHS Compliant: Yes; Series: -; Case Code (Imperial): 0402; Voltage Rating: 50V; Min Operating Temperature: -55°C; Mount: Surface Mount; Case/Package: 0402; Packaging: Cut Tape
C301B = CMP-06035-003589-1: as C301A on sheet MPPT_1; Case Code (Imperial): 1206; Voltage Rating (DC): 25V; Voltage Rating: 25V; Length: 3.2mm; Lead Free: Lead Free; Thickness: 0.071inch; Package Quantity: 1; Width: 1.6mm; Max Operating Temperature: 125°C; Number of Pins: 2; Height: 1.6mm; Case Code (Metric): 3216; REACH SVHC: No SVHC; Radiation Hardening: No; Case/Package: 1206; Material: Ceramic; Tolerance: 10%; Voltage: 25V; Mount: Surface Mount; Packaging: Tape and Reel; Dielectric: X7R; Termination: SMD/SMT; Min Operating Temperature: -55°C; Capacitance: 10uF; Depth: 1.6mm
C303B = CMP-2006-02592-1: as C303A on sheet MPPT_1
C304B C305B = CMP-2007-03385-2: as C304A on sheet MPPT_1; Material: Ceramic; Max Operating Temperature: 85°C; Voltage: 6.3V; Min Operating Temperature: -55°C; Case/Package: 0805; Thickness: 0.053inch; Dielectric: X5R; Packaging: Tape and Reel; Depth: 1.25mm; Termination: SMD/SMT; Voltage Rating (DC): 6.3V; Radiation Hardening: No; Tolerance: 20%; Mount: Surface Mount; Lead Free: Lead Free; Package Quantity: 1; REACH SVHC: No SVHC; Voltage Rating: 6.3V; Capacitance: 22uF; Length: 2mm; Case Code (Imperial): 0805; Case Code (Metric): 2012; Width: 0.049inch; Height: 1.25mm
C306B = CMP-2007-03234-1: as C306A on sheet MPPT_1
C320B = CMP-2000-06011-1: as C302A on sheet MPPT_1; Datasheet URL: http://www.kemet.com/docfinder?Partnumber=C1206C105K5RACTU; Product Category: MultilayerCeramicCapacitorsMLCC-SMD/SMT; Termination Style: SMD/SMT; Dimensions: 1.6mmWx3.2mmLx1mmH; Voltage Rating DC: 50V; Datasheet Version: 02/2016; Packaging: Reel; Brand: Kemet; RoHS: Details; Minimum Operating Temperature: -55C; Operating Temperature Range: -55Cto+125C; Package Reference: 1206; Manufacturer URL: http://www.kemet.com/; Product: GeneralTypeMLCCs; Tolerance: 10%; Package Description: 2-Pin Surface Mount Device, Body 3.2 x 1.6 mm; Mounting Technology: SurfaceMount; Case Code - mm: 3216; Maximum Operating Temperature: +125C; Series: C1206C; Factory Pack Quantity: 2500; Package / Case: 1206(3216metric); Case Code - in: 1206
J300B J301B = XT30PW-M: as J300A on sheet MPPT_1; SnapEDA_Link: https://www.snapeda.com/parts/XT30PW-M/AMASS/view-part/?ref=snap; Package: None; Value: *; MP: XT30PW-M; Check_prices: https://www.snapeda.com/parts/XT30PW-M/AMASS/view-part/?ref=eda
L300B = CMP-0227-00113-2: as L300A on sheet MPPT_1; RoHS: Compliant; Ambient Temperature Range Low: -40°C; Case/Package: Nonstandard; Composition: Wirewound; Height - Seated (Max): 4.4958mm; Mount: Surface Mount; Max DC Current: 2A; Length: 7.3mm; Termination: SMD/SMT; Depth: 7.3mm; Lead Pitch: 4mm; Ambient Temperature Range High: 85°C; Max Operating Temperature: 125°C; Width: 7.3mm; Lead Free: Lead Free; Min Operating Temperature: -40°C; Tolerance: 20%; Packaging: Cut Tape (CT); Number of Pins: 2; Height: 4.5mm
R300B = CMP-02407-013157-1: as R300A on sheet MPPT_1; Features: Moisture Resistant; Number of Pins: 2; RoHS Compliant: No; Packaging: Tape and Reel; Power Rating: 1W; Height: 0.635mm; Tolerance: 1%; Case Code (Imperial): 2512; Number of Terminations: 2; Resistor Type: Metal Strip; Technology: METAL STRIP; Case Code (Metric): 6432; Max Operating Temperature: 170°C; Package Quantity: 2000; Termination: SMD/SMT; Reach SVHC Compliant: Yes; Width: 3.2mm; Military Standard: Not; Construction: Rectangular; Contact Plating: Tin; Radiation Hardening: No; Lead Free: Lead Free; Weight: 0.002243oz; Max Power Dissipation: 1W; Min Operating Temperature: -65°C; Resistance Tolerance: 1%; Case/Package: 2512; Depth: 3.18mm; Length: 6.4mm; Size Code: 2512; Series: WSL
R301B R302B R304B = CMP-1666-00005-4: as R200 on sheet MICROCONTROLER; Max Operating Temperature: 155 degC; PackageDescription: 2-Pin Surface Mount Device, Body 1.575 x 0.85 mm; ComponentLink1Description: Manufacturer URL; RoHSCompliant: true; PackageReference: 0603; REACH SVHC: Unknown; Length: 1.55 mm; DatasheetVersion: 06/2012; Packaging: Tape and Reel; Min Operating Temperature: -55 degC; Mounting Technology: Surface Mount; ComponentLink2URL: https://datasheet.ciiva.com/11809/0900766b80d98afc-11809037.pdf; Height: 0.45 mm; ComponentLink2Description: Datasheet; Package Quantity: 5000; ComponentLink1URL: http://www.vishay.com/
R303B = CMP-2002-07490-1: as R303A on sheet MPPT_1
R305B = CMP-2001-04043-1: as R305A on sheet MPPT_1
R306B = CMP-2003-00293-1: ERJ-8ENF3093V; Manufacturer: Panasonic; Part Number: ERJ-8ENF3093V
U300B = CMP-0491-02169-2: as U300A on sheet MPPT_1; Max Operating Temperature: 125°C; Output Current: 2.5A; RoHS Compliant: Yes; Case/Package: QFN; Package Quantity: 2500; Lead Free: Lead Free; Series: -; Number of Pins: 24; Min Operating Temperature: -40°C; Packaging: Tape and Reel

## Sheet IDEAL_DIODE_1.SchDoc
size A; SheetNumber: 4; SheetTotal: 10
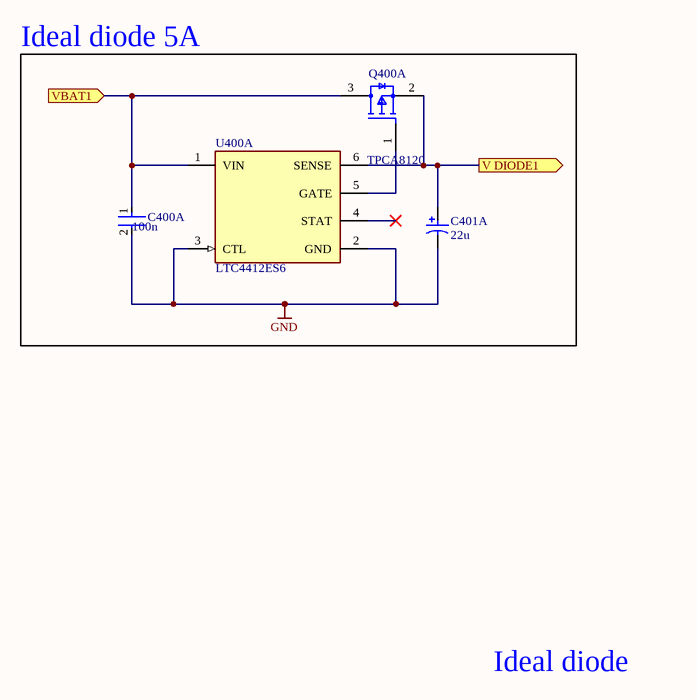
[diagram p4: IDEAL_DIODE_1.SchDoc]

### Parts
C400A  100n  [FP-0603-L_1_6_0_15-W_0_81-IPC_A]
C401A  22u  [KEMT-T491-B_L]
Q400A  TPCA8120  [FP-527AG-MFG]
U400A  LTC4412ES6  [FP-S6-6-05-08-1636-IPC_C]

### Blocks framed on the sheet
Ideal diode 5A: C400A C401A Q400A U400A

### Ports
V DIODE1 (out), VBAT1 (in, see 3[3A], 5[4B])

### Nets
GND: C400A.2 C401A.2 U400A.2(GND) U400A.3(CTL)
V DIODE1: C401A.1 Q400A.2(S) U400A.6(SENSE) ; port V DIODE1
Net?_2: C400A.1 Q400A.3(D) U400A.1(VIN) ; port VBAT1
NetQ400A_1: Q400A.1(G) U400A.5(GATE)

Not connected (* = marked no-connect by the designer): U400A 4(STAT)*

### Notes on the sheet
- Ideal diode

### Library data of the parts
C400A = CMP-2006-04386-2: Automotive Ceramic Capacitor, 0603, 100nF, 10%, X7R, 15%, 50V; Dissipation Factor: 2.5%; Insulation Resistance: 100GR; Package Quantity: 1; Radiation Hardening: No; Contact Plating: Tin; Width: 0.032inch; Voltage Rating (DC): 50V; Dielectric Material: Ceramic; Length: 1.6mm; Thickness: 0.035inch; Min Operating Temperature: -55°C; Voltage: 50V; Depth: 0.81mm; Max Operating Temperature: 125°C; Series: -; Dielectric: X7R; Tolerance: 10%; Mount: Surface Mount; Termination: SMD/SMT; Ratings: AEC-Q200; Lead Free: Lead Free; Case Code (Imperial): 0603; Case/Package: 0603; Voltage Rating: 50V; Case Code (Metric): 1608; Capacitance: 100nF; RoHS Compliant: Yes; Number of Pins: 2; REACH SVHC: No SVHC; Construction: Flat; Height: 0.9mm; Packaging: Tape and Reel
C401A = CMP-2000-07193-1: Tantalum Capacitor, 22 uF, +/- 10%, 10 V, -55 to 125 degC, 2-Pin SMD, RoHS, Tape and Reel; Manufacturer: Kemet; Lead Spacing (nom): NotRequiredmm; Polarity: Polar; Insulation: NotRequired; Voltage: 10VDC; DCL: 2.2uA; ESR: 2.4ohm; Rad Hardened: No; Capacitance: 22000000pF; Product Length (mm): 3.5mm; Case Style: Molded; Product Depth (mm): 2.8mm; DF: 6%; Product Height (mm): 1.9mm; Seated Plane Height: NotRequiredmm; Failure Rate: NotRequired; Datasheet URL: http://capacitoredge.kemet.com/capedge2/DataSheet/Datasheet-T491B226K010AT.pdf?pn=T491B226K010AT; Mounting Technology: SurfaceMount; Datasheet Version: 10/2016; Construction: SMTChip; Package Reference: T491-B; Product Diameter (mm): NotRequiredmm; Operating Temp Range: -55Cto125C; Manufacturer URL: http://www.kemet.com/; Wire Form: NotRequired; Tolerance (+ or -): 10%; Case Code: B; Packaging: TapeandReel; Length W/Weld: NotRequiredmm; Package Description: 2-Pin Surface Mount Device, Body 3.5 x 2.8 mm; Length W/Weld (max): NotRequiredmm; Seal: NotRequired; Mounting Style: SurfaceMount; Package / Case: 3528-21
Q400A = CMP-2100-03638-2: MOSFET P-CH 20V 2A SSOT3; Fall Time: 11ns; Rise Time: 9ns; Voltage Rating (DC): -20V; Power Dissipation: 500mW; Nominal Vgs: -800mV; Current Rating: -2A; Gate to Source Voltage (Vgs): 8V; Rds On Max: 70mR; Turn-Off Delay Time: 27ns; Element Configuration: Single; Number of Elements: 1; Input Capacitance: 779pF; Drain to Source Resistance: 60mR; Turn-On Delay Time: 10ns; Package Quantity: 1; Mount: Surface Mount; Case/Package: SOT-23; Min Operating Temperature: -55°C; REACH SVHC: No SVHC; Weight: 0.03g; Packaging: Tape and Reel; Threshold Voltage: -800mV; Max Operating Temperature: 150°C; Dual Supply Voltage: -20V; Termination: SMD/SMT; Drain to Source Voltage (Vdss): 20V; Height: 0.94mm; Length: 2.92mm; Contact Plating: Tin; Width: 3.05mm; Drain to Source Breakdown Voltage: -20V; Max Power Dissipation: 500mW; Continuous Drain Current (ID): 2A; Number of Pins: 3; Lead Free: Lead Free; Radiation Hardening: No; On-State Resistance: 70MR
U400A = CMP-0479-00425-2: IC OR CTRLR SRC SELECT TSOT23-6; Min Supply Voltage: 2.5V; Max Supply Voltage: 28V; Turn-On Delay Time: 110us; Number of Channels: 1; Lead Free: Lead Free; Length: 2.9mm; Radiation Hardening: No; RoHS Compliant: Yes; Package Quantity: 1; Min Operating Temperature: -40°C; Series: PowerPath™; Packaging: Tape and Reel; Width: 1.75mm; Height: 0.9mm; Number of Pins: 6; Max Operating Temperature: 85°C; Number of Outputs: 1; Case/Package: TSOT; REACH SVHC: No SVHC

## Sheet IDEAL_DIODE_2.SchDoc
size A; SheetNumber: 2; SheetTotal: 10
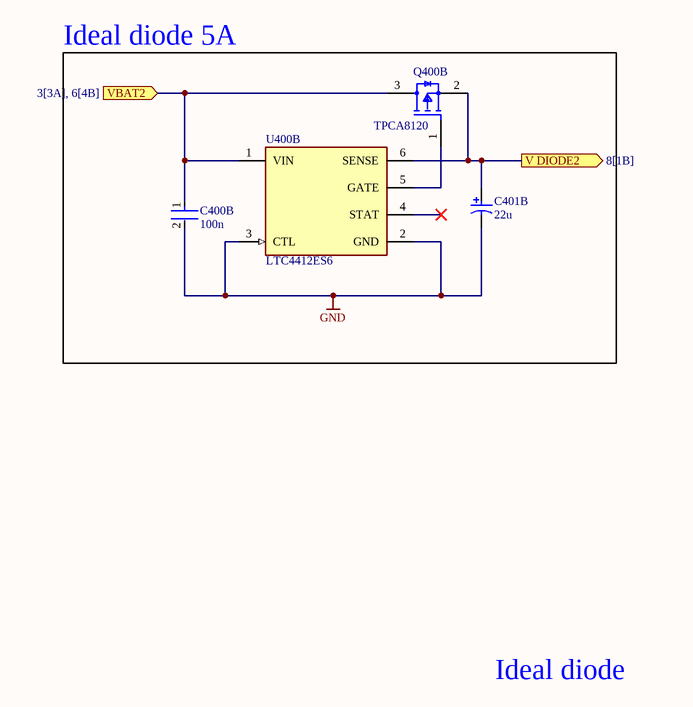
[diagram p5: IDEAL_DIODE_2.SchDoc]

### Parts
C400B  100n  [FP-0603-L_1_6_0_15-W_0_81-IPC_A]
C401B  22u  [KEMT-T491-B_L]
Q400B  TPCA8120  [FP-527AG-MFG]
U400B  LTC4412ES6  [FP-S6-6-05-08-1636-IPC_C]

### Blocks framed on the sheet
Ideal diode 5A: C400B C401B Q400B U400B

### Ports
V DIODE2 (out, see 8[1B]), VBAT2 (in, see 3[3A], 6[4B])

### Nets
GND: C400B.2 C401B.2 U400B.2(GND) U400B.3(CTL)
NetC303B_1: C400B.1 Q400B.3(D) U400B.1(VIN) ; port VBAT2
NetC401B_1: C401B.1 Q400B.2(S) U400B.6(SENSE) ; port V DIODE2
NetQ400B_1: Q400B.1(G) U400B.5(GATE)

Not connected (* = marked no-connect by the designer): U400B 4(STAT)*

### Notes on the sheet
- Ideal diode

### Library data of the parts
C400B = CMP-2006-04386-2: as C400A on sheet IDEAL_DIODE_1; Package Quantity: 1; Radiation Hardening: No; Contact Plating: Tin; Width: 0.032inch; Voltage Rating (DC): 50V; Dielectric Material: Ceramic; Length: 1.6mm; Thickness: 0.035inch; Min Operating Temperature: -55°C; Voltage: 50V; Depth: 0.81mm; Max Operating Temperature: 125°C; Series: -; Dielectric: X7R; Tolerance: 10%; Mount: Surface Mount; Termination: SMD/SMT; Ratings: AEC-Q200; Lead Free: Lead Free; Case Code (Imperial): 0603; Case/Package: 0603; Voltage Rating: 50V; Case Code (Metric): 1608; Capacitance: 100nF; RoHS Compliant: Yes; Number of Pins: 2; REACH SVHC: No SVHC; Construction: Flat; Height: 0.9mm; Packaging: Tape and Reel
C401B = CMP-2000-07193-1: as C401A on sheet IDEAL_DIODE_1; Seated Plane Height: NotRequiredmm; Failure Rate: NotRequired; Datasheet URL: http://capacitoredge.kemet.com/capedge2/DataSheet/Datasheet-T491B226K010AT.pdf?pn=T491B226K010AT; Mounting Technology: SurfaceMount; Datasheet Version: 10/2016; Construction: SMTChip; Package Reference: T491-B; Product Diameter (mm): NotRequiredmm; Operating Temp Range: -55Cto125C; Manufacturer URL: http://www.kemet.com/; Wire Form: NotRequired; Tolerance (+ or -): 10%; Case Code: B; Packaging: TapeandReel; Length W/Weld: NotRequiredmm; Package Description: 2-Pin Surface Mount Device, Body 3.5 x 2.8 mm; Length W/Weld (max): NotRequiredmm; Seal: NotRequired; Mounting Style: SurfaceMount; Package / Case: 3528-21
Q400B = CMP-2100-03638-2: as Q400A on sheet IDEAL_DIODE_1; Package Quantity: 1; Mount: Surface Mount; Case/Package: SOT-23; Min Operating Temperature: -55°C; REACH SVHC: No SVHC; Weight: 0.03g; Packaging: Tape and Reel; Threshold Voltage: -800mV; Max Operating Temperature: 150°C; Dual Supply Voltage: -20V; Termination: SMD/SMT; Drain to Source Voltage (Vdss): 20V; Height: 0.94mm; Length: 2.92mm; Contact Plating: Tin; Width: 3.05mm; Drain to Source Breakdown Voltage: -20V; Max Power Dissipation: 500mW; Continuous Drain Current (ID): 2A; Number of Pins: 3; Lead Free: Lead Free; Radiation Hardening: No; On-State Resistance: 70MR
U400B = CMP-0479-00425-2: as U400A on sheet IDEAL_DIODE_1; Lead Free: Lead Free; Length: 2.9mm; Radiation Hardening: No; RoHS Compliant: Yes; Package Quantity: 1; Min Operating Temperature: -40°C; Series: PowerPath™; Packaging: Tape and Reel; Width: 1.75mm; Height: 0.9mm; Number of Pins: 6; Max Operating Temperature: 85°C; Number of Outputs: 1; Case/Package: TSOT; REACH SVHC: No SVHC

## Sheet Buck-Boost_1.SchDoc
size A4; SheetNumber: 7; SheetTotal: 10
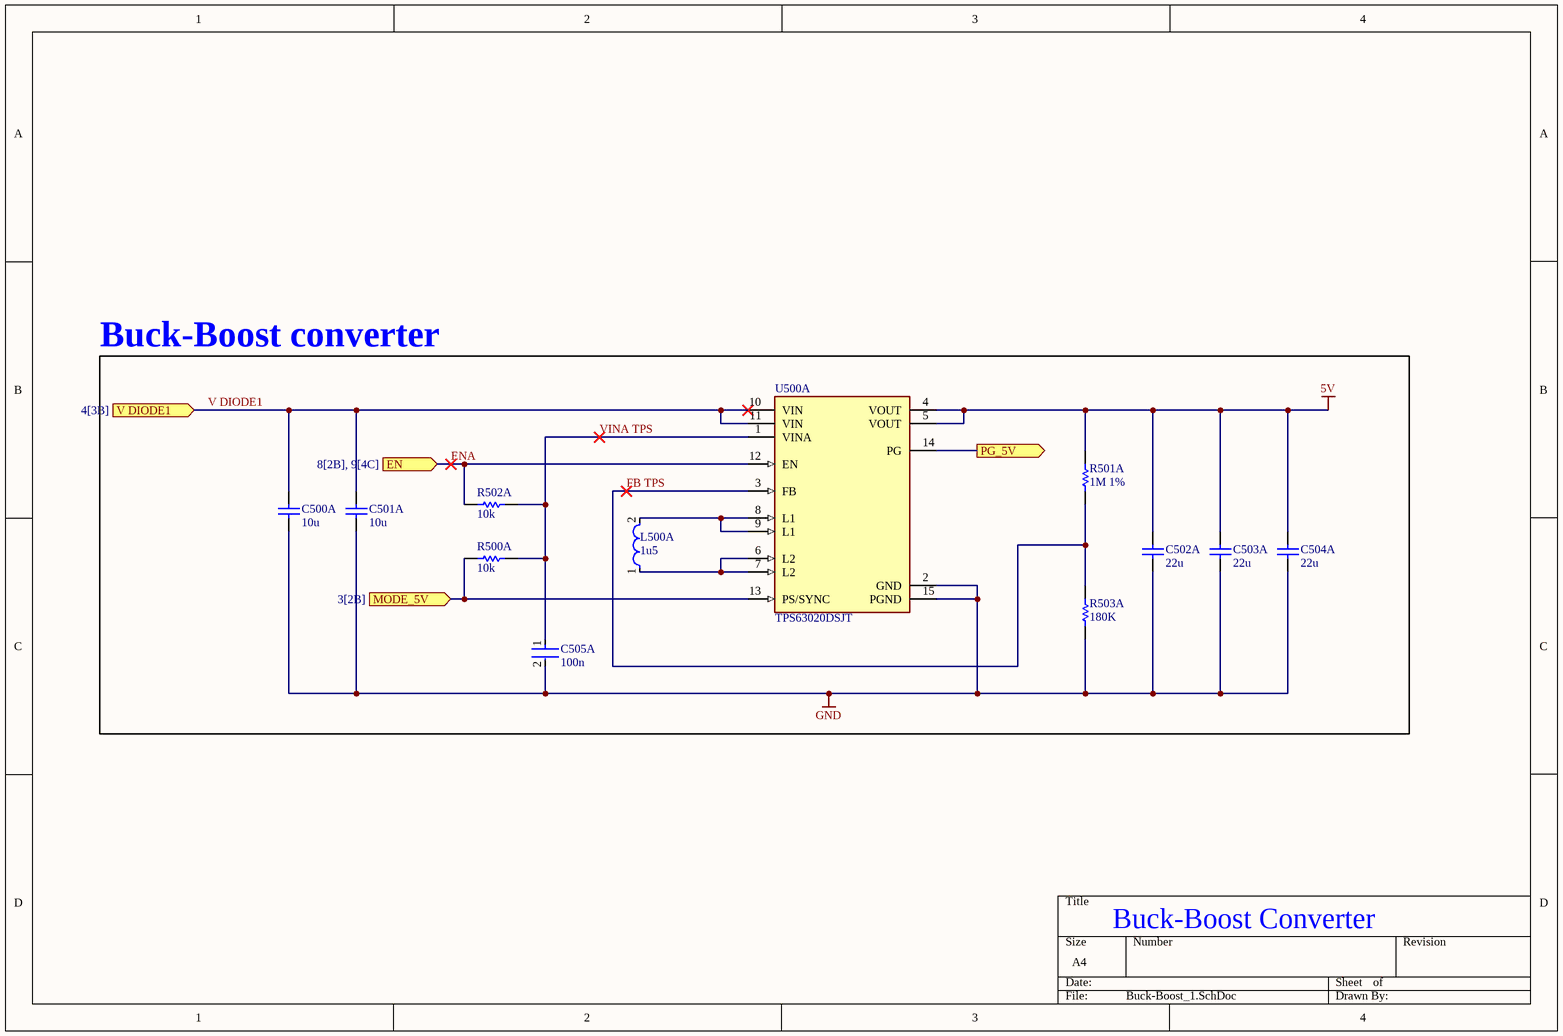
[diagram p6: Buck-Boost_1.SchDoc]

### Parts
C500A  10u  [CAPC3216X180X50LL20T25]
C501A  10u  [CAPC3216X180X50LL20T25]
C502A  22u  [CAPC1206(3216)190_L]
C503A  22u  [CAPC1206(3216)190_L]
C504A  22u  [CAPC1206(3216)190_L]
C505A  100n  [FP-CGA3E-0_3-0_1-IPC_A]
L500A  1u5  [FP-DFE252010C-IPC_A]
R500A  10k  [RESC2013X60X35NL10T20]
R501A  1M 1%  [RESC1608X55X25LL10T15]
R502A  10k  [RESC2013X60X35NL10T20]
R503A  180K  [RESC1005X40X25NL05T10]
U500A  TPS63020DSJT  [FP-DSJ0014A-MFG]

### Blocks framed on the sheet
Buck-Boost converter: C500A C501A C502A C503A C504A C505A L500A R500A R501A R502A R503A U500A

### Ports
EN (in, see 8[2B], 9[4C]), MODE_5V (in, see 3[2B]), PG_5V (out, see 3[2B]), V DIODE1 (in, see 4[3B])

### Nets
5V: C502A.2 C503A.2 C504A.2 R501A.2 U500A.4(VOUT) U500A.5(VOUT)
GND: C500A.1 C501A.1 C502A.1 C503A.1 C504A.1 C505A.2 R503A.1 U500A.2(GND) U500A.15(PGND)
ENA: R502A.1 U500A.12(EN) ; port EN  [project net EN B]
FB TPS: R501A.1 R503A.2 U500A.3(FB)
V DIODE1: C500A.2 C501A.2 U500A.10(VIN) U500A.11(VIN) ; port V DIODE1
VINA TPS: C505A.1 R500A.2 R502A.2 U500A.1(VINA)
NetL500A_1: L500A.1 U500A.6(L2) U500A.7(L2)
NetL500A_2: L500A.2 U500A.8(L1) U500A.9(L1)
NetR500A_1: R500A.1 U500A.13(PS/SYNC) ; port MODE_5V
NetU200_27: U500A.14(PG) ; port PG_5V

### Notes on the sheet
- Buck-Boost Converter

### Library data of the parts
C500A C501A = CMP-2000-06013-1: Chip Capacitor, 10 uF, +/- 10%, 10 V, -55 to 125 degC, 1206 (3216 Metric), RoHS, Tape and Reel; Type: SMDMLCCX7R6.3-250VDCCommericalGrade; Class: Class1; Case Height: 1.6mm; Temperature Coefficient / Code: +/-15%; Capacitance: 10uF; Brand: Kemet; Case Length: 3.2mm; Dissipation Factor DF: 5; Voltage Rating: 10V; Dielectric: X7R; Tolerance: 10%; Package Reference: 1206; Dimensions: 1.6mmWx3.2mmLx1.6mmH; Series: C1206C; Minimum Operating Temperature: -55C; RoHS: Details; Termination Style: SMD/SMT; Mounting Technology: SurfaceMount; Manufacturer: Kemet; Product Category: MultilayerCeramicCapacitorsMLCC-SMD/SMT; Case Code - mm: 3216; Manufacturer URL: http://www.kemet.com/; Product: GeneralTypeMLCCs; Package Description: 2-Pin Surface Mount Device, Body 3.2 x 1.6 mm; Case Width: 1.6mm; Factory Pack Quantity: 2000; Package / Case: 1206(3216metric); Datasheet URL: http://www.kemet.com/docfinder?Partnumber=C1206C106K8RACTU; Datasheet Version: 02/2016; Operating Temperature Range: -55Cto+125C; Voltage Rating DC: 10V; Case Code - in: 1206; Maximum Operating Temperature: +125C; Packaging: Reel
C502A C503A C504A = CMP-1037-04986-1: CAP 22uF 6.3V ±20% 1206 (3216 Metric) Thickness 1.9mm SMD; Case-EIA: 1206; Tolerance: Â±20%; Case-Metric: 3216; Value: 22uF; Max Thickness: 1.9 mm; Rated Voltage: 6.3 V; Technology: SMT
C505A = CMP-2000-07546-2: Cap Ceramic 100nF 50V X7R 10% Pad SMD 0603 +125°C Automotive T/R; Weight: 7.1E-05oz; Composition: Ceramic; Max Operating Temperature: 125°C; Termination: SMD/SMT; Dielectric: X7R; Length: 1.6mm; Package Quantity: 1; REACH SVHC: No SVHC; Lead Free: Lead Free; Case Code (Metric): 1608; Min Operating Temperature: -55°C; Packaging: Tape and Reel; Tolerance: 10%; Voltage Rating: 50V; Case Code (Imperial): 0603; Capacitance: 100nF; Case/Package: 0603; Voltage Rating (DC): 50V; Depth: 0.8mm; Radiation Hardening: No; Ratings: AEC-Q200; Mount: Surface Mount; Voltage: 50V; Thickness: 0.035inch; Width: 0.8mm; Height: 0.8mm
L500A = CMP-06042-006286-1: Shielded Wirewound Inductor 1.5uH  2500mA 0.072Ω 1008 (2520); Current Rating: 2.5A; DC Resistance (DCR): 72mR; Core Material: Ferrite; Test Frequency: 1MHz; Saturation Current: 3.8A; Tolerance: 20%; Width: 0.079inch; Case Code (Metric): 2520; Case/Package: 1008; Height - Seated (Max): 0.039inch; Min Operating Temperature: -40°C; Inductance: 1.5uH; Case Code (Imperial): 1008; Shielding: Shielded; Mount: Surface Mount; Length: 0.098inch; Packaging: Tape and Reel; Max Operating Temperature: 125°C
R500A R502A = CMP-1659-00013-4: Chip Resistor, 10 KOhm, +/- 1%, 0.125 W, -55 to 155 degC, 0805 (2012 Metric), RoHS, Tape and Reel; Manufacturer: Yageo; Voltage Rating: 150 V; Mount: Surface Mount; ComponentLink1Description: Manufacturer URL; ComponentLink2URL: http://www.yageo.com/documents/recent/PYu-RC_Group_51_RoHS_L_04.pdf; Pins: 2; Length: 2 mm; Min Operating Temperature: -55 degC; Height: 0.5 mm; Mounting Technology: Surface Mount; RoHSCompliant: true; REACH SVHC: No SVHC; ComponentLink1URL: http://www.yageo.com/; Max Operating Temperature: 155 degC; PackageReference: 0805; DatasheetVersion: Rev. 4, 02/2016; Package Quantity: 5000; Packaging: Tape and Reel; ComponentLink2Description: Datasheet; PackageDescription: 2-Pin Surface Mounted Device, Body 2 x 1.25 mm
R501A = CMP-1659-00056-1: Chip Resistor, 1 MOhm, +/- 1%, 100 mW, -55 to 155 degC, 0603 (1608 Metric), RoHS, Tape and Reel; Voltage Rating (DC): 25 V; Tolerance: 20%; Case\Package: Radial; Capacitance: 1 mF; Min Operating Temperature: -40 degC; PackageDescription: 2-Pin Surface Mount Device, Body 1.6 x 0.8 mm; ComponentLink1Description: Manufacturer URL; Radiation Hardening: No; DatasheetVersion: Rev. 4, 02/2016; REACH SVHC: No SVHC; Length: 20 mm; Max Operating Temperature: 85 degC; Diameter: 10 mm; Packaging: Bulk; Package Quantity: 200; PackageReference: 0603; Mount: Through Hole; ComponentLink1URL: http://www.yageo.com/; ComponentLink2URL: http://www.yageo.com/documents/recent/PYu-RC_Group_51_RoHS_L_04.pdf; ComponentLink2Description: Datasheet; Width: 0 inch; Lead Pitch: 5 mm; RoHSCompliant: true; Voltage Rating: 25 V; Height: 20 mm
R503A = CMP-1011-00763-4: Chip Resistor, 180 KOhm, +/- 1%, 62.5 mW, -55 to 155 degC, 0402 (1005 Metric), RoHS, Tape and Reel; Manufacturer: Basic Passives; PartNumber: RC0402FR-07180KL; Power Rating: 62.5 mW; Voltage Rating: 50 V; Case\/Package: 0402; Length: 1 mm; RoHSCompliant: true; Mounting Technology: Surface Mount; Min Operating Temperature: -55 degC; PackageDescription: 2-Pin Surface Mount Device, Body 1 x 0.5 mm; Case Code (Imperial): 0402; Resistance: 180 KOhm; ComponentLink2URL: http://download.siliconexpert.com/pdfs/2016/1/13/0/45/27/830/yageo_/manual/8727809758379137pyu-rc_group_51_rohs_l___3.pdf; Packaging: Tape and Reel; Tolerance: 1%; Width: 0.5 mm; PackageReference: 0402; Max Operating Temperature: 155 degC; Package Quantity: 200; Height: 0.35 mm; Mount: Surface Mount; Pins: 2; DatasheetVersion: 12/2015; ComponentLink1URL: http://www.yageo.com/; ComponentLink1Description: Manufacturer URL; Case Code (Metric): 1005; REACH SVHC: No SVHC; ComponentLink2Description: Datasheet
U500A = CMP-2000-07282-2: IC REG BCK BST ADJ 3.5A 14VSON; Manufacturer: Texas Instruments; Switching Frequency: 2400kHz; Output Voltage: 1.2-5.5V; Nominal Supply Current: 25uA; Standoff Height: 0mm; Switching Topology: Buck-Boost; Min Supply Voltage: 1.8V; Output Type: AdjustableProgrammable; Max Junction Temp: +125°C; Number Of Outputs: 1; Output Current: 3A; Max Supply Voltage: 5.5V; ComponentLink2URL: https://www.ti.com/lit/ds/symlink/tps63020.pdf; Ambient Temperature Range High: +85°C; Digikey Description: IC REG BCK BST ADJ 3.5A 14VSON; Ambient Temperature Range Low: -40°C; Manufacturer Part Number: TPS63020DSJT; Automotive: No; Package: DSJ0014A; Category: IC; Temperature Range High: +85°C; Temperature: -40°C to +85°C; Octopart: https://octopart.com/tps63020dsjt-texas+instruments-12976119; Temperature Range Low: -40°C; Device Class L3: Voltage Regulators - Switching; Device Class L2: Power Management ICs; RoHS: TRUE; Lead Free: Yes; Height: 1mm; Device Class L1: Integrated Circuits (ICs); Mouser Description: Voltage Regulators - Switching Regulators 93% Eff Buck-Boost Converter; ComponentLink2Description: Datasheet